# EAGLE schematic M865B (EAGLE 6.6.0)

## Sheet 1 of 2
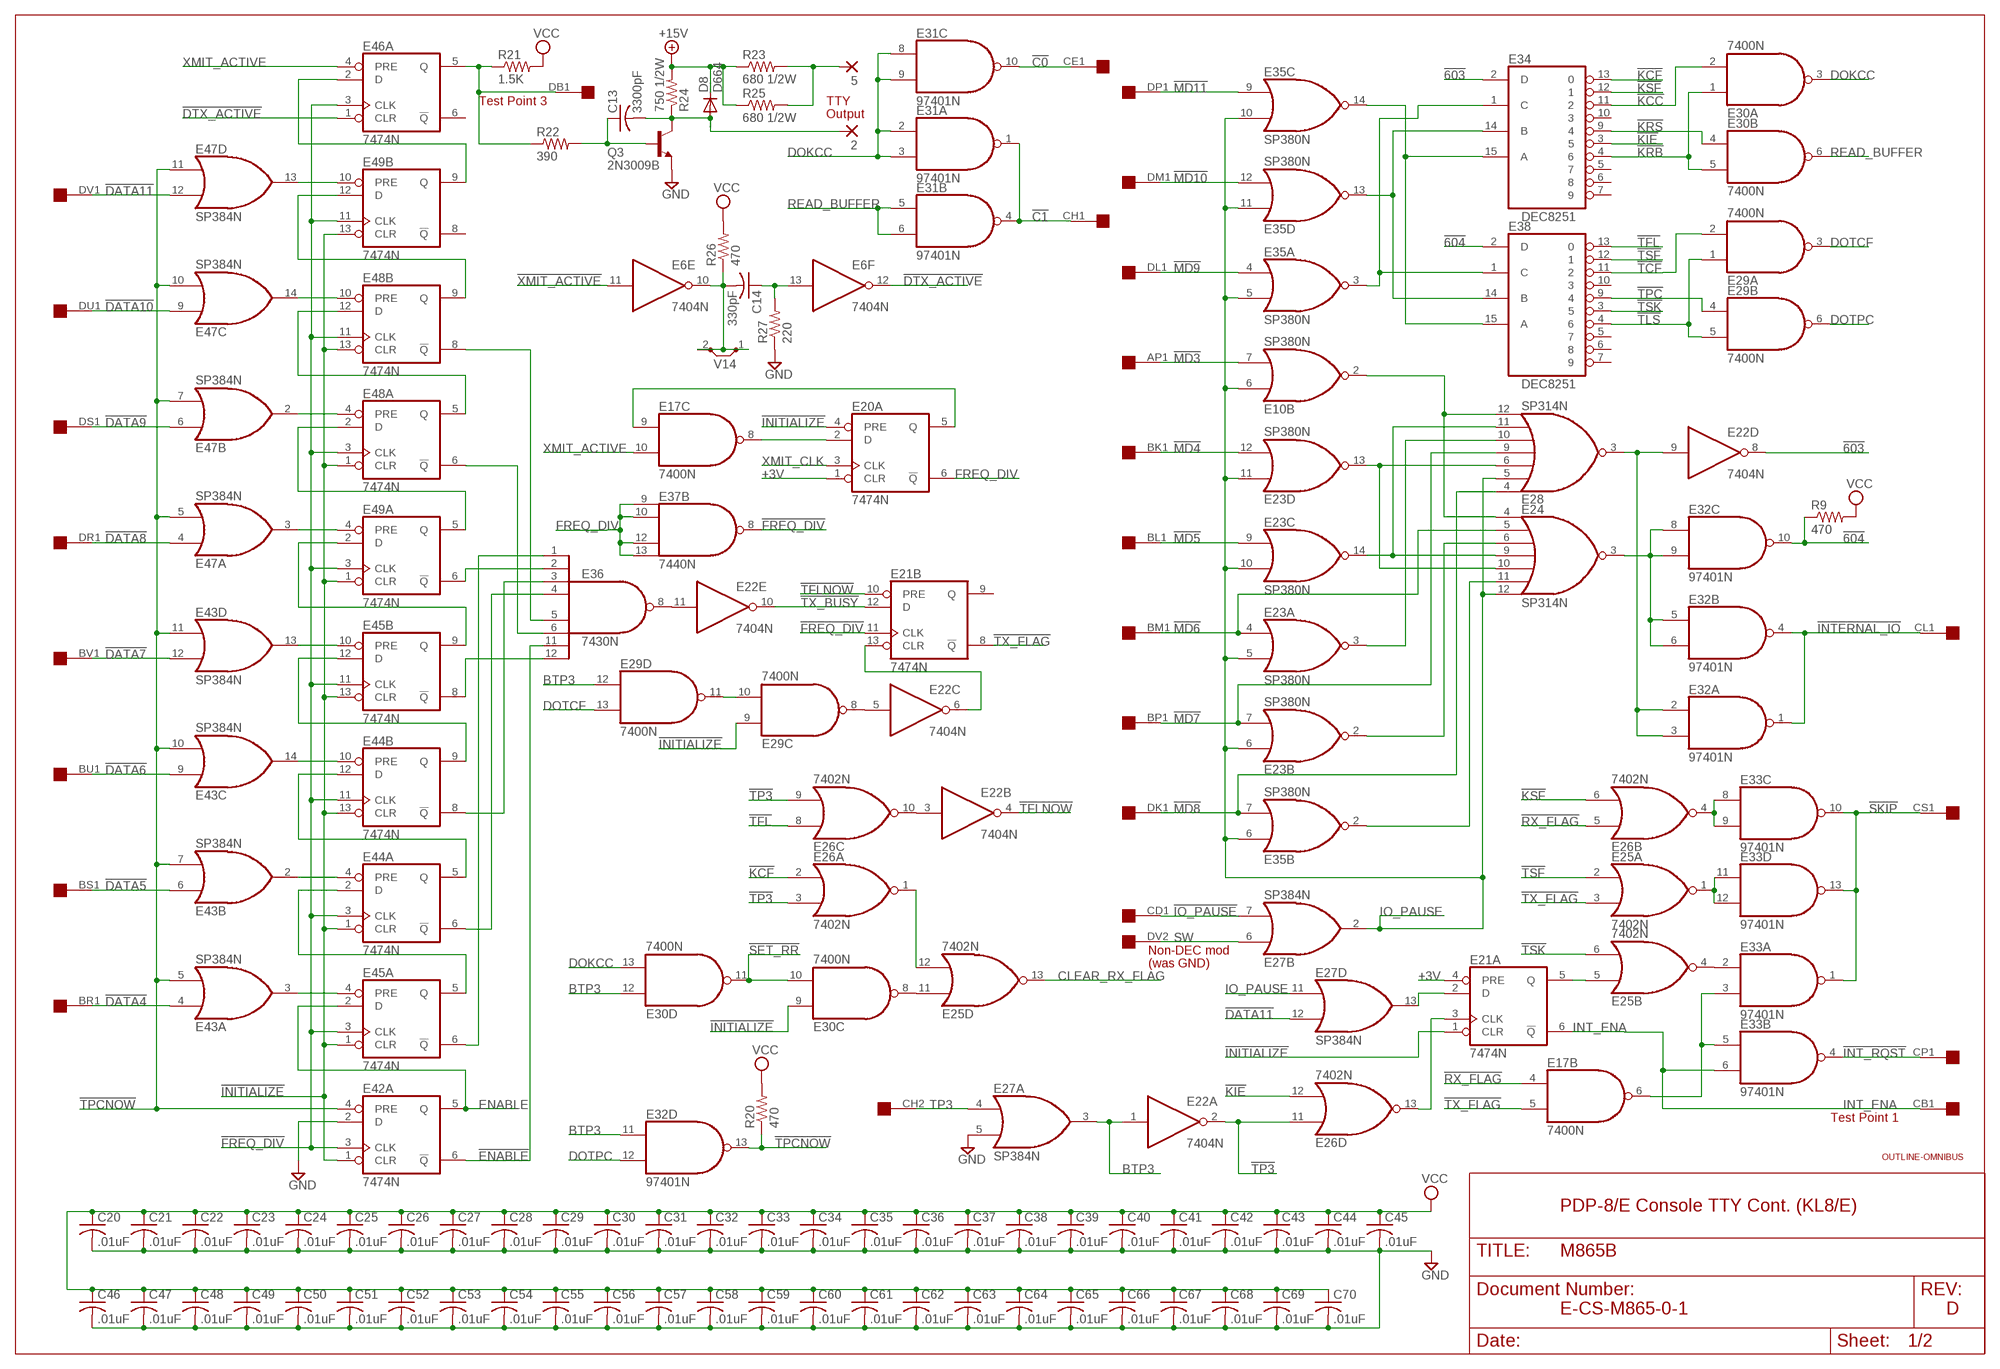
[diagram p0: schematic, sheet 1]

### Parts
2  2,15/1,0  [2,15/1,0]
5  2,15/1,0  [2,15/1,0]
C13  3300pF  C-US102-043X133  [C102-043X133]
C14  330pF  C-US050-025X075  [C050-025X075]
C20  .01uF  C-US050-025X075  [C050-025X075]
C21  .01uF  C-US050-025X075  [C050-025X075]
C22  .01uF  C-US050-025X075  [C050-025X075]
C23  .01uF  C-US050-025X075  [C050-025X075]
C24  .01uF  C-US050-025X075  [C050-025X075]
C25  .01uF  C-US050-025X075  [C050-025X075]
C26  .01uF  C-US050-025X075  [C050-025X075]
C27  .01uF  C-US050-025X075  [C050-025X075]
C28  .01uF  C-US050-025X075  [C050-025X075]
C29  .01uF  C-US050-025X075  [C050-025X075]
C30  .01uF  C-US050-025X075  [C050-025X075]
C31  .01uF  C-US050-025X075  [C050-025X075]
C32  .01uF  C-US050-025X075  [C050-025X075]
C33  .01uF  C-US050-025X075  [C050-025X075]
C34  .01uF  C-US050-025X075  [C050-025X075]
C35  .01uF  C-US050-025X075  [C050-025X075]
C36  .01uF  C-US050-025X075  [C050-025X075]
C37  .01uF  C-US050-025X075  [C050-025X075]
C38  .01uF  C-US050-025X075  [C050-025X075]
C39  .01uF  C-US050-025X075  [C050-025X075]
C40  .01uF  C-US050-025X075  [C050-025X075]
C41  .01uF  C-US050-025X075  [C050-025X075]
C42  .01uF  C-US050-025X075  [C050-025X075]
C43  .01uF  C-US050-025X075  [C050-025X075]
C44  .01uF  C-US050-025X075  [C050-025X075]
C45  .01uF  C-US050-025X075  [C050-025X075]
C46  .01uF  C-US050-025X075  [C050-025X075]
C47  .01uF  C-US050-025X075  [C050-025X075]
C48  .01uF  C-US050-025X075  [C050-025X075]
C49  .01uF  C-US050-025X075  [C050-025X075]
C50  .01uF  C-US050-025X075  [C050-025X075]
C51  .01uF  C-US050-025X075  [C050-025X075]
C52  .01uF  C-US050-025X075  [C050-025X075]
C53  .01uF  C-US050-025X075  [C050-025X075]
C54  .01uF  C-US050-025X075  [C050-025X075]
C55  .01uF  C-US050-025X075  [C050-025X075]
C56  .01uF  C-US050-025X075  [C050-025X075]
C57  .01uF  C-US050-025X075  [C050-025X075]
C58  .01uF  C-US050-025X075  [C050-025X075]
C59  .01uF  C-US050-025X075  [C050-025X075]
C60  .01uF  C-US050-025X075  [C050-025X075]
C61  .01uF  C-US050-025X075  [C050-025X075]
C62  .01uF  C-US050-025X075  [C050-025X075]
C63  .01uF  C-US050-025X075  [C050-025X075]
C64  .01uF  C-US050-025X075  [C050-025X075]
C65  .01uF  C-US050-025X075  [C050-025X075]
C66  .01uF  C-US050-025X075  [C050-025X075]
C67  .01uF  C-US050-025X075  [C050-025X075]
C68  .01uF  C-US050-025X075  [C050-025X075]
C69  .01uF  C-US050-025X075  [C050-025X075]
C70  .01uF  C-US050-025X075  [C050-025X075]
D8  D664  DIODE-DO35-10  [DO35-10]
E6  7404N  [DIL14]
E10  SP380N  [DIL14]
E17  7400N  [DIL14]
E20  7474N  74S74N  [DIL14]
E21  7474N  74S74N  [DIL14]
E22  7404N  [DIL14]
E23  SP380N  [DIL14]
E24  SP314N  [DIL14]
E25  7402N  [DIL14]
E26  7402N  [DIL14]
E27  SP384N  [DIL14]
E28  SP314N  [DIL14]
E29  7400N  [DIL14]
E30  7400N  [DIL14]
E31  97401N  74LS01N  [DIL14]
E32  97401N  74LS01N  [DIL14]
E33  97401N  74LS01N  [DIL14]
E34  DEC8251  [DIL16]
E35  SP380N  [DIL14]
E36  7430N  [DIL14]
E37  7440N  [DIL14]
E38  DEC8251  [DIL16]
E42  7474N  74S74N  [DIL14]
E43  SP384N  [DIL14]
E44  7474N  74S74N  [DIL14]
E45  7474N  74S74N  [DIL14]
E46  7474N  74S74N  [DIL14]
E47  SP384N  [DIL14]
E48  7474N  74S74N  [DIL14]
E49  7474N  74S74N  [DIL14]
Q3  2N3009B  -NPN-TO5  [TO5]
R9  470  R-US_0207/10  [0207/10]
R20  470  R-US_0207/10  [0207/10]
R21  1.5K  R-US_0207/10  [0207/10]
R22  390  R-US_0207/10  [0207/10]
R23  680 1/2W  R-US_0411/15  [0411/15]
R24  750 1/2W  R-US_0411/15  [0411/15]
R25  680 1/2W  R-US_0411/15  [0411/15]
R26  470  R-US_0207/10  [0207/10]
R27  220  R-US_0207/10  [0207/10]
U$1  QUAD  [EDGE-CON8]
U$2  OUTLINE-OMNIBUS  [OMNIBUS]
V14  J10MM  [10]

### Nets
603X: E22.9(D:I) E28.3(O) E32.2(A:I0) E32.3(A:I1)
604X: E24.3(O) E32.5(B:I0) E32.6(B:I1) E32.8(C:I0) E32.9(C:I1)
!603: E22.8(D:O) E34.2(D)
!604: E32.10(C:O) E38.2(D) R9.1
!C0: E31.10(C:O) U$1.CE1
!C1: E31.1(A:O) E31.4(B:O) U$1.CH1
!DATA4: E43.4(A:I0) U$1.BR1 ; also sheet 2
!DATA5: E43.6(B:I0) U$1.BS1 ; also sheet 2
!DATA6: E43.9(C:I0) U$1.BU1 ; also sheet 2
!DATA7: E43.12(D:I1) U$1.BV1 ; also sheet 2
!DATA8: E47.4(A:I0) U$1.DR1 ; also sheet 2
!DATA9: E47.6(B:I0) U$1.DS1 ; also sheet 2
!DATA10: E47.9(C:I0) U$1.DU1 ; also sheet 2
!DATA11: E27.12(D:I1) E47.12(D:I1) U$1.DV1 ; also sheet 2
!DTX_ACTIVE: E6.12(F:O) E46.1(A:CLR)
!ENABLE: E36.11(I6) E42.6(A:!Q)
!FREQ_DIV: E21.11(B:CLK) E37.8(B:O) E42.3(A:CLK) E44.3(A:CLK) E44.11(B:CLK) E45.3(A:CLK) E45.11(B:CLK) E46.3(A:CLK) E48.3(A:CLK) E48.11(B:CLK) E49.3(A:CLK) E49.11(B:CLK) ; also sheet 2
!INITIALIZE: E20.4(A:PRE) E21.1(A:CLR) E29.9(C:I0) E30.9(C:I0) E42.1(A:CLR) E44.1(A:CLR) E44.13(B:CLR) E45.1(A:CLR) E45.13(B:CLR) E48.1(A:CLR) E48.13(B:CLR) E49.1(A:CLR) E49.13(B:CLR) ; also sheet 2
!INT_ENA: E21.5(A:Q) E25.5(B:I0)
!INT_RQST: E33.4(B:O) U$1.CP1
!INTERNAL_IO: E32.1(A:O) E32.4(B:O) U$1.CL1
!IO_PAUSE: E27.7(B:I1) U$1.CD1
!KCC: E30.2(A:I1) E34.11
!KCF: E26.2(A:I0) E34.13
!KIE: E26.12(D:I1) E34.3
!KRB: E30.1(A:I0) E30.5(B:I1) E34.4
!KRS: E30.4(B:I0) E34.9
!KSF: E26.6(B:I1) E34.12
!MD3: E10.7(B:I1) U$1.AP1
!MD4: E23.12(D:I1) U$1.BK1
!MD5: E23.9(C:I0) U$1.BL1
!MD6: E23.4(A:I0) E24.5(I1) U$1.BM1
!MD7: E23.7(B:I1) E28.9(I3) U$1.BP1
!MD8: E28.4(I0) E35.7(B:I1) U$1.DK1
!MD9: E35.4(A:I0) U$1.DL1
!MD10: E35.12(D:I1) U$1.DM1
!MD11: E35.9(C:I0) U$1.DP1
!RX_FLAG: E17.4(B:I0) E26.5(B:I0) ; also sheet 2
!SET_RR: E30.10(C:I1) E30.11(D:O) ; also sheet 2
!SKIP: E33.1(A:O) E33.10(C:O) E33.13(D:O) U$1.CS1
!TCF: E29.2(A:I1) E38.11
!TFL: E26.8(C:I0) E38.13
!TFLNOW: E21.10(B:PRE) E22.4(B:O)
!TLS: E29.1(A:I0) E29.5(B:I1) E38.4
!TP3: E22.2(A:O) E26.3(A:I1) E26.9(C:I1) E26.11(D:I0)
!TPC: E29.4(B:I0) E38.9
!TPCNOW: E32.13(D:O) E42.4(A:PRE) E43.5(A:I1) E43.7(B:I1) E43.10(C:I1) E43.11(D:I0) E47.5(A:I1) E47.7(B:I1) E47.10(C:I1) E47.11(D:I0) R20.1
!TSF: E25.2(A:I0) E38.12
!TSK: E25.6(B:I1) E38.3
!TX_BUSY: E21.12(B:D) E22.10(E:O) ; also sheet 2
!TX_FLAG: E17.5(B:I1) E21.8(B:!Q) E25.3(A:I1)
!XMIT_ACTIVE: E6.11(E:I) ; also sheet 2
+3V [Supply]: E20.1(A:CLR) E21.4(A:PRE) ; also sheet 2
+15V [Supply]: D8.C R23.1 R24.2 R25.1 ; also sheet 2
BTP3: E22.1(A:I) E27.3(A:O) E29.12(D:I0) E30.12(D:I0) E32.11(D:I0)
CLEAR_RX_FLAG: E25.13(D:O) ; also sheet 2
DOKCC: E30.3(A:O) E30.13(D:I1) E31.2(A:I0) E31.3(A:I1) E31.8(C:I0) E31.9(C:I1)
DOTCF: E29.3(A:O) E29.13(D:I1)
DOTPC: E29.6(B:O) E32.12(D:I1)
ENABLE: E42.5(A:Q) E45.2(A:D) ; also sheet 2
FREQ_DIV: E20.6(A:!Q) E37.9(B:I0) E37.10(B:I1) E37.12(B:I2) E37.13(B:I3) ; also sheet 2
GND [Supply]: C20.2 C21.2 C22.2 C23.2 C24.2 C25.2 C26.2 C27.2 C28.2 C29.2 C30.2 C31.2 C32.2 C33.2 C34.2 C35.2 C36.2 C37.2 C38.2 C39.2 C40.2 C41.2 C42.2 C43.2 C44.2 C45.2 C46.2 C47.2 C48.2 C49.2 C50.2 C51.2 C52.2 C53.2 C54.2 C55.2 C56.2 C57.2 C58.2 C59.2 C60.2 C61.2 C62.2 C63.2 C64.2 C65.2 C66.2 C67.2 C68.2 C69.2 C70.2 E27.5(A:I1) E42.2(A:D) Q3.1(E) R27.1 ; also sheet 2
INT_ENA: E21.6(A:!Q) E33.6(B:I1) U$1.CB1
IO_PAUSE: E10.6(B:I0) E23.5(A:I1) E23.6(B:I0) E23.10(C:I1) E23.11(D:I0) E24.12(I6) E27.2(B:O) E27.11(D:I0) E28.5(I1) E35.5(A:I1) E35.6(B:I0) E35.10(C:I1) E35.11(D:I0)
N$1: E25.11(D:I0) E30.8(C:O)
N$2: E47.13(D:O) E49.10(B:PRE)
N$3: E47.14(C:O) E48.10(B:PRE)
N$4: E47.2(B:O) E48.4(A:PRE)
N$5: E47.3(A:O) E49.4(A:PRE)
N$6: E48.9(B:Q) E49.12(B:D)
N$7: E22.5(C:I) E29.8(C:O)
N$9: E43.13(D:O) E45.10(B:PRE)
N$10: E43.14(C:O) E44.10(B:PRE)
N$11: E43.3(A:O) E45.4(A:PRE)
N$12: E43.2(B:O) E44.4(A:PRE)
N$13: E44.2(A:D) E45.5(A:Q)
N$14: E44.5(A:Q) E44.12(B:D)
N$15: E44.9(B:Q) E45.12(B:D)
N$16: E45.9(B:Q) E49.2(A:D)
N$17: E48.2(A:D) E49.5(A:Q)
N$18: E48.5(A:Q) E48.12(B:D)
N$20: E36.5(I4) E48.8(B:!Q)
N$21: E36.6(I5) E48.6(A:!Q)
N$22: E36.2(I1) E49.6(A:!Q)
N$23: E36.12(I7) E45.8(B:!Q)
N$24: E36.3(I2) E44.8(B:!Q)
N$25: E36.4(I3) E44.6(A:!Q)
N$26: E36.1(I0) E45.6(A:!Q)
N$28: E46.2(A:D) E49.9(B:Q)
N$31: E46.5(A:Q) R21.1 R22.1 U$1.DB1
N$32: E22.11(E:I) E36.8(O)
N$33: E24.11(I5) E35.2(B:O)
N$34: E23.2(B:O) E24.6(I2)
N$35: E23.3(A:O) E28.10(I4)
N$36: E23.14(C:O) E24.9(I3) E28.11(I5)
N$37: E23.13(D:O) E24.10(I4) E28.6(I2)
N$38: E10.2(B:O) E24.4(I0) E28.12(I6)
N$39: E26.4(B:O) E33.8(C:I0) E33.9(C:I1)
N$40: E34.15(A) E35.14(C:O) E38.15(A)
N$41: E34.14(B) E35.13(D:O) E38.14(B)
N$42: E34.1(C) E35.3(A:O) E38.1(C)
N$43: E25.1(A:O) E33.11(D:I0) E33.12(D:I1)
N$44: E17.6(B:O) E33.3(A:I1) E33.5(B:I0)
N$45: E21.2(A:D) E27.13(D:O)
N$46: E25.4(B:O) E33.2(A:I0)
N$47: E21.3(A:CLK) E26.13(D:O)
N$58: E17.8(C:O) E20.2(A:D)
N$64: E17.9(C:I0) E20.5(A:Q)
N$65: C13.1 Q3.2(B) R22.2
N$66: 2.1(P) C13.2 D8.A Q3.3(C) R24.1
N$67: 5.1(P) R23.2 R25.2
N$77: C14.2 E6.10(E:O) R26.1 V14.1 V14.2
N$78: C14.1 E6.13(F:I) R27.2
N$126: E25.12(D:I1) E26.1(A:O)
N$127: E22.3(B:I) E26.10(C:O)
N$128: E29.10(C:I1) E29.11(D:O)
N$130: E21.13(B:CLR) E22.6(C:O)
READ_BUFFER: E30.6(B:O) E31.5(B:I0) E31.6(B:I1) ; also sheet 2
SW: E27.6(B:I0) U$1.DV2
TP3: E27.4(A:I0) U$1.CH2
VCC [Supply]: C20.1 C21.1 C22.1 C23.1 C24.1 C25.1 C26.1 C27.1 C28.1 C29.1 C30.1 C31.1 C32.1 C33.1 C34.1 C35.1 C36.1 C37.1 C38.1 C39.1 C40.1 C41.1 C42.1 C43.1 C44.1 C45.1 C46.1 C47.1 C48.1 C49.1 C50.1 C51.1 C52.1 C53.1 C54.1 C55.1 C56.1 C57.1 C58.1 C59.1 C60.1 C61.1 C62.1 C63.1 C64.1 C65.1 C66.1 C67.1 C68.1 C69.1 C70.1 R9.2 R20.2 R21.2 R26.2 ; also sheet 2
XMIT_ACTIVE: E17.10(C:I1) E46.4(A:PRE) ; also sheet 2
XMIT_CLK: E20.3(A:CLK) ; also sheet 2
Unconnected: E17.1(A:I0) E17.2(A:I1) E17.3(A:O) E20.8(B:!Q) E20.9(B:Q) E20.10(B:PRE) E20.11(B:CLK) E20.12(B:D) E20.13(B:CLR) E21.9(B:Q) E31.11(D:I0) E31.12(D:I1) E31.13(D:O) E34.5 E34.6 E34.7 E34.10 E36.9 E36.10 E36.13 E37.3(3:NC) E37.11(11:NC) E38.5 E38.6 E38.7 E38.10 E46.6(A:!Q) E49.8(B:!Q) U$1.AB2 U$1.AC1 U$1.AD1 U$1.AD2 U$1.AE1 U$1.AE2 U$1.AH1 U$1.AH2 U$1.AJ1 U$1.AJ2 U$1.AK1 U$1.AK2 U$1.AL1 U$1.AL2 U$1.AM1 U$1.AM2 U$1.AP2 U$1.AR1 U$1.AR2 U$1.AS1 U$1.AS2 U$1.AU1 U$1.AU2 U$1.AV1 U$1.AV2 U$1.BB2 U$1.BD1 U$1.BD2 U$1.BE1 U$1.BE2 U$1.BH1 U$1.BH2 U$1.BJ1 U$1.BJ2 U$1.BK2 U$1.BL2 U$1.BM2 U$1.BP2 U$1.BR2 U$1.BS2 U$1.BU2 U$1.CB2 U$1.CD2 U$1.CE2 U$1.CJ1 U$1.CJ2 U$1.CK1 U$1.CK2 U$1.CL2 U$1.CM1 U$1.CM2 U$1.CP2 U$1.CR2 U$1.CS2 U$1.CU1 U$1.CU2 U$1.CV1 U$1.CV2 U$1.DD1 U$1.DD2 U$1.DE1 U$1.DE2 U$1.DH1 U$1.DH2 U$1.DJ1 U$1.DJ2 U$1.DK2 U$1.DL2 U$1.DM2 U$1.DP2 U$1.DR2 U$1.DS2 U$1.DU2

### Notes on the sheet
- Test Point 3 | TTY
- Output
- Non-DEC mod
- (was GND)
- Test Point 1
- PDP-8/E Console TTY Cont. (KL8/E)
- E-CS-M865-0-1 | D

## Sheet 2 of 2
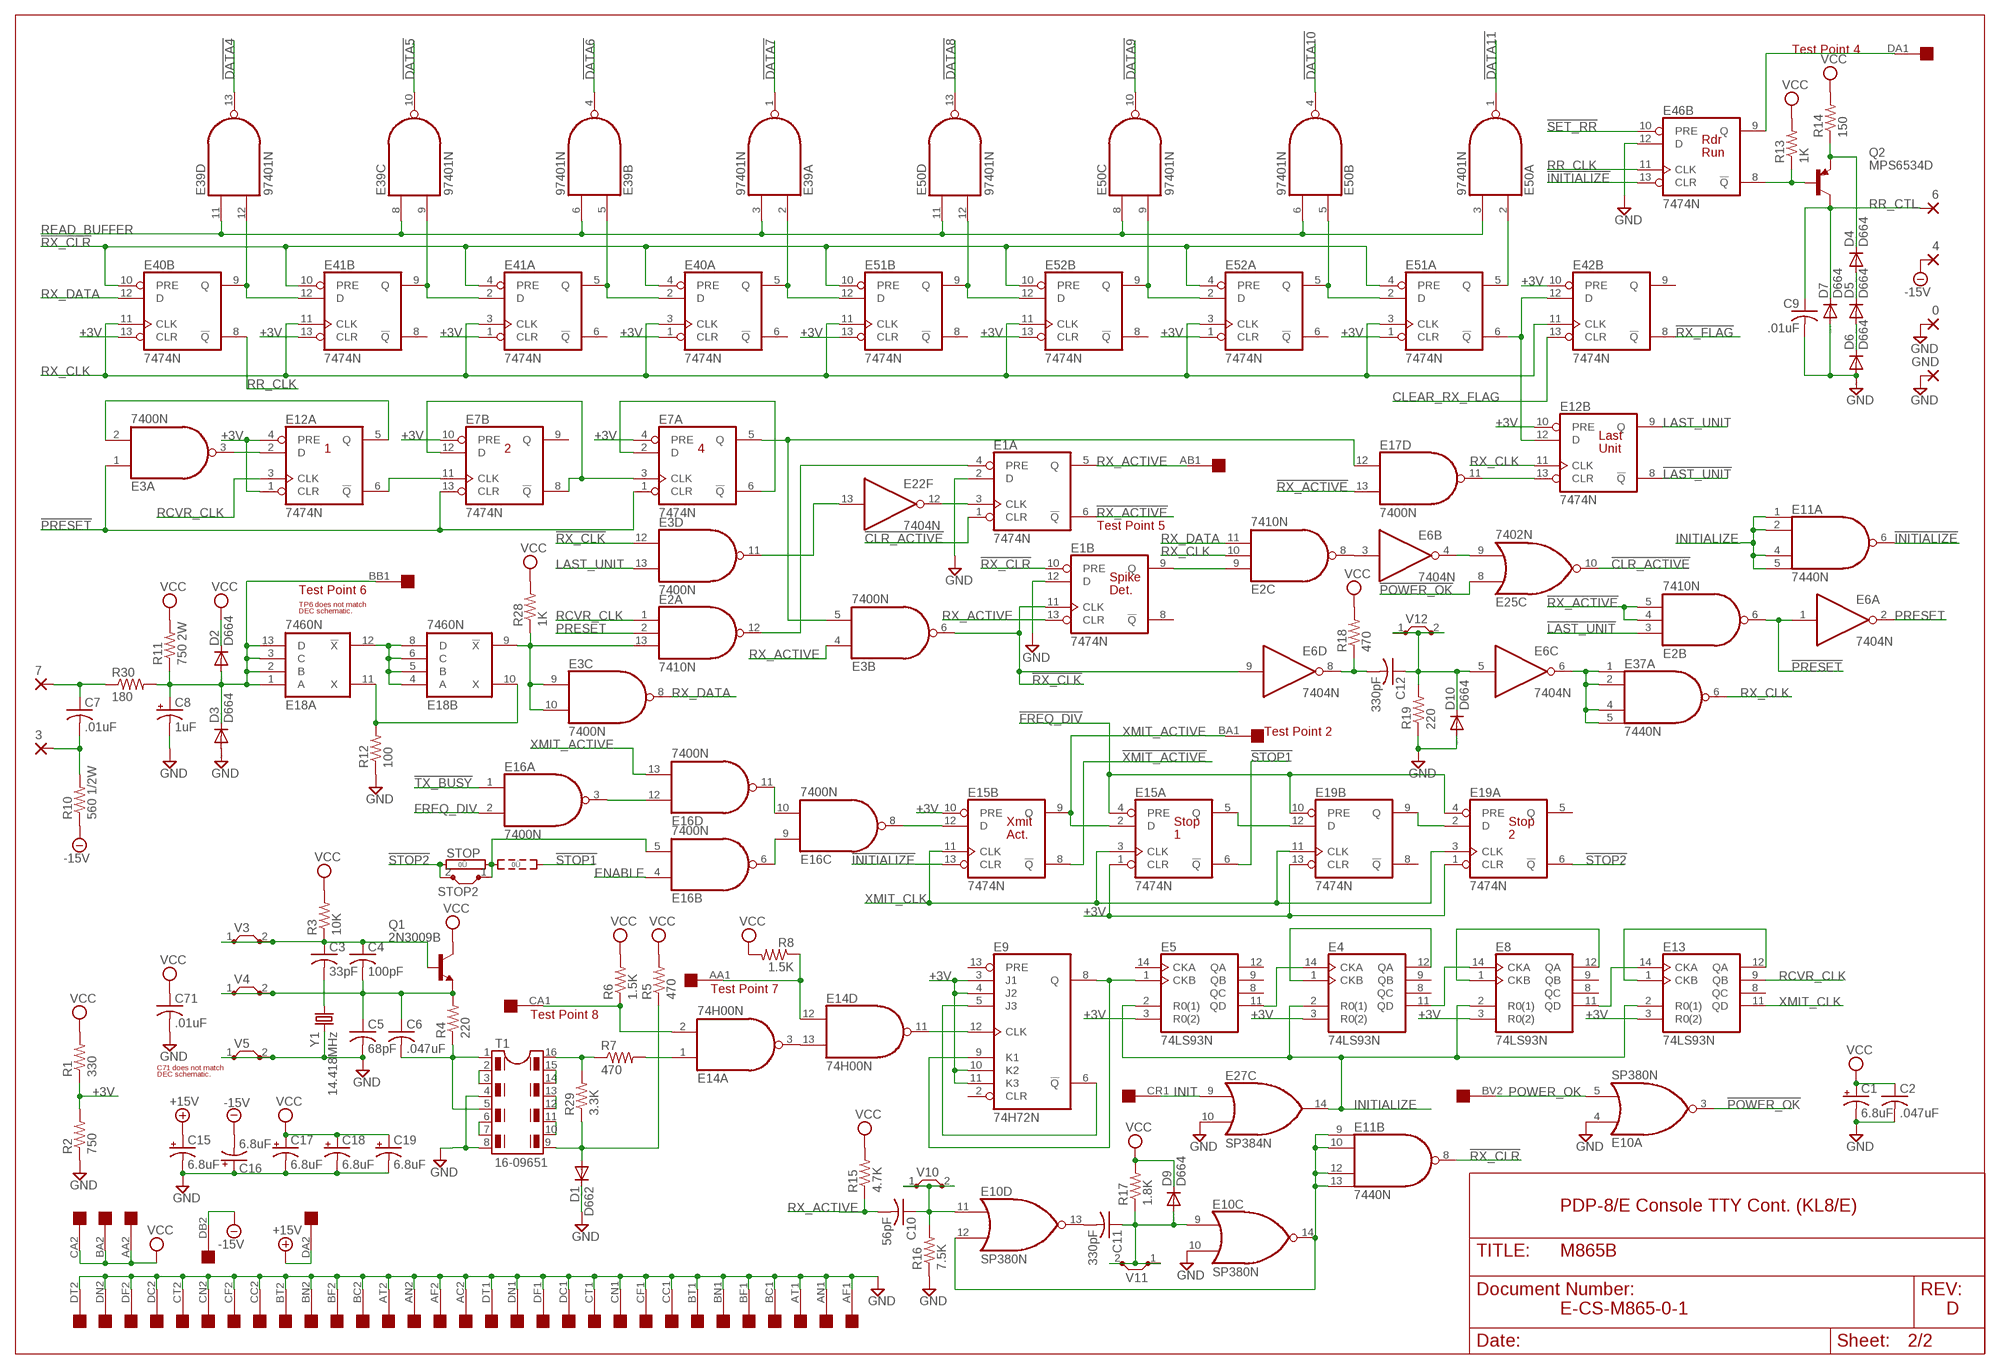
[diagram p1: schematic, sheet 2]

### Parts
0  2,15/1,0  [2,15/1,0]
3  2,15/1,0  [2,15/1,0]
4  2,15/1,0  [2,15/1,0]
6  2,15/1,0  [2,15/1,0]
7  2,15/1,0  [2,15/1,0]
C1  6.8uF  CPOL-USE20-8AXIAL  [E12-8]
C2  .047uF  C-US075-032X103  [C075-032X103]
C3  33pF  C-US050-025X075  [C050-025X075]
C4  100pF  C-US050-025X075  [C050-025X075]
C5  68pF  C-US050-025X075  [C050-025X075]
C6  .047uF  C-US075-032X103  [C075-032X103]
C7  .01uF  C-US050-025X075  [C050-025X075]
C8  1uF  CPOL-USE15-5AXIAL  [E15-5]
C9  .01uF  C-US050-025X075  [C050-025X075]
C10  56pF  C-US050-025X075  [C050-025X075]
C11  330pF  C-US050-025X075  [C050-025X075]
C12  330pF  C-US050-025X075  [C050-025X075]
C15  6.8uF  CPOL-USE20-8AXIAL  [E12-8]
C16  6.8uF  CPOL-USE20-8AXIAL  [E12-8]
C17  6.8uF  CPOL-USE20-8AXIAL  [E12-8]
C18  6.8uF  CPOL-USE20-8AXIAL  [E12-8]
C19  6.8uF  CPOL-USE20-8AXIAL  [E12-8]
C71  .01uF  C-US050-025X075  [C050-025X075]
D1  D662  DIODE-DO35-10  [DO35-10]
D2  D664  DIODE-DO35-10  [DO35-10]
D3  D664  DIODE-DO35-10  [DO35-10]
D4  D664  DIODE-DO35-10  [DO35-10]
D5  D664  DIODE-DO35-10  [DO35-10]
D6  D664  DIODE-DO35-10  [DO35-10]
D7  D664  DIODE-DO35-10  [DO35-10]
D9  D664  DIODE-DO35-10  [DO35-10]
D10  D664  DIODE-DO35-10  [DO35-10]
E1  7474N  74S74N  [DIL14]
E2  7410N  [DIL14]
E3  7400N  [DIL14]
E4  74LS93N  [DIL14]
E5  74LS93N  [DIL14]
E7  7474N  74S74N  [DIL14]
E8  74LS93N  [DIL14]
E9  74H72N  7472N  [DIL14]
E11  7440N  [DIL14]
E12  7474N  74S74N  [DIL14]
E13  74LS93N  [DIL14]
E14  74H00N  7400N  [DIL14]
E15  7474N  74S74N  [DIL14]
E16  7400N  [DIL14]
E18  7460N  [DIL14]
E19  7474N  74S74N  [DIL14]
E39  97401N  74LS01N  [DIL14]
E40  7474N  74S74N  [DIL14]
E41  7474N  74S74N  [DIL14]
E50  97401N  74LS01N  [DIL14]
E51  7474N  74S74N  [DIL14]
E52  7474N  74S74N  [DIL14]
GND  2,15/1,0  [2,15/1,0]
Q1  2N3009B  -NPN-TO5  [TO5]
Q2  MPS6534D  -PNP-TO5  [TO5]
R1  330  R-US_0207/10  [0207/10]
R2  750  R-US_0207/10  [0207/10]
R3  10K  R-US_0207/10  [0207/10]
R4  220  R-US_0207/10  [0207/10]
R5  470  R-US_0207/10  [0207/10]
R6  1.5K  R-US_0207/10  [0207/10]
R7  470  R-US_0207/10  [0207/10]
R8  1.5K  R-US_0207/10  [0207/10]
R10  560 1/2W  R-US_0411/15  [0411/15]
R11  750 2W  R-US_0818/25  [0818/25]
R12  100  R-US_0207/10  [0207/10]
R13  1K  R-US_0207/10  [0207/10]
R14  150  R-US_0207/10  [0207/10]
R15  4.7K  R-US_0207/10  [0207/10]
R16  7.5K  R-US_0207/10  [0207/10]
R17  1.8K  R-US_0207/10  [0207/10]
R18  470  R-US_0207/10  [0207/10]
R19  220  R-US_0207/10  [0207/10]
R28  1K  R-US_0207/10  [0207/10]
R29  3.3K  R-US_0207/10  [0207/10]
R30  180  R-US_0207/10  [0207/10]
STOP  0R2  [0R2/10]
STOP2  J10MM  [10]
T1  16-09651  DIL16  [DIL16]
V3  J10MM  [10]
V4  J10MM  [10]
V5  J10MM  [10]
V10  J10MM  [10]
V11  J10MM  [10]
V12  J10MM  [10]
Y1  14.418MHz  CRYSTALHC18U-H  [HC18U-H]

### Nets
!CLR_ACTIVE: E1.1(A:CLR) E25.10(C:O)
!DATA4: E39.13(D:O) ; also sheet 1
!DATA5: E39.10(C:O) ; also sheet 1
!DATA6: E39.4(B:O) ; also sheet 1
!DATA7: E39.1(A:O) ; also sheet 1
!DATA8: E50.13(D:O) ; also sheet 1
!DATA9: E50.10(C:O) ; also sheet 1
!DATA10: E50.4(B:O) ; also sheet 1
!DATA11: E50.1(A:O) ; also sheet 1
!FREQ_DIV: E15.4(A:PRE) E19.4(A:PRE) E19.10(B:PRE) ; also sheet 1
!INITIALIZE: E11.6(A:O) E15.13(B:CLR) E46.13(B:CLR) ; also sheet 1
!LAST_UNIT: E2.3(B:I0) E12.8(B:!Q)
!POWER_OK: E10.3(A:O) E25.8(C:I0)
!PRESET: E2.6(B:O) E3.1(A:I0) E6.1(A:I) E7.1(A:CLR) E7.13(B:CLR)
!RX_ACTIVE: E1.6(A:!Q) E2.4(B:I1) E2.5(B:I2) E17.13(D:I1)
!RX_CLK: E1.11(B:CLK) E3.6(B:O) E3.12(D:I0) E6.9(D:I)
!RX_CLR: E1.10(B:PRE) E11.8(B:O) E40.4(A:PRE) E40.10(B:PRE) E41.4(A:PRE) E41.10(B:PRE) E51.4(A:PRE) E51.10(B:PRE) E52.4(A:PRE) E52.10(B:PRE)
!RX_FLAG: E42.8(B:!Q) ; also sheet 1
!SET_RR: E46.10(B:PRE) ; also sheet 1
!STOP1: E15.6(A:!Q) STOP.3
!STOP2: E19.6(A:!Q) STOP2.2 STOP.1
!TX_BUSY: E16.1(A:I0) ; also sheet 1
!XMIT_ACTIVE: E15.8(B:!Q) ; also sheet 1
+3V [Supply]: E4.3(R0(2)) E5.3(R0(2)) E7.4(A:PRE) E7.10(B:PRE) E8.3(R0(2)) E9.3(J1) E9.4(J2) E9.10(K2) E9.11(K3) E12.1(A:CLR) E12.4(A:PRE) E12.10(B:PRE) E13.3(R0(2)) E15.1(A:CLR) E15.10(B:PRE) E19.1(A:CLR) E19.13(B:CLR) E40.1(A:CLR) E40.13(B:CLR) E41.1(A:CLR) E41.13(B:CLR) E42.10(B:PRE) E51.1(A:CLR) E51.13(B:CLR) E52.1(A:CLR) E52.13(B:CLR) R1.1 R2.2 ; also sheet 1
+15V [Supply]: C15.+ U$1.DA2 ; also sheet 1
-15V [Supply]: 4.1(P) C16.- R10.1 U$1.DB2
CLEAR_RX_FLAG: E42.13(B:CLR) ; also sheet 1
ENABLE: E16.4(B:I0) ; also sheet 1
FREQ_DIV: E16.2(A:I1) ; also sheet 1
GND [Supply]: 0.1(P) C1.- C2.2 C5.2 C8.- C9.2 C15.- C16.+ C17.- C18.- C19.- C71.2 D1.C D3.A D6.A D7.A D10.A E1.2(A:D) E1.12(B:D) E10.4(A:I0) E10.10(C:I1) E27.10(C:I1) E46.12(B:D) GND.1(P) R2.1 R12.1 R16.1 R19.1 T1.4 T1.8 U$1.AC2 U$1.AF1 U$1.AF2 U$1.AN1 U$1.AN2 U$1.AT1 U$1.AT2 U$1.BC1 U$1.BC2 U$1.BF1 U$1.BF2 U$1.BN1 U$1.BN2 U$1.BT1 U$1.BT2 U$1.CC1 U$1.CC2 U$1.CF1 U$1.CF2 U$1.CN1 U$1.CN2 U$1.CT1 U$1.CT2 U$1.DC1 U$1.DC2 U$1.DF1 U$1.DF2 U$1.DN1 U$1.DN2 U$1.DT1 U$1.DT2 V5.1 V5.2 Y1.2 ; also sheet 1
INIT: E27.9(C:I0) U$1.CR1
INITIALIZE: E4.2(R0(1)) E5.2(R0(1)) E8.2(R0(1)) E11.1(A:I0) E11.2(A:I1) E11.4(A:I2) E11.5(A:I3) E13.2(R0(1)) E27.14(C:O)
LAST_UNIT: E3.13(D:I1) E12.9(B:Q)
N$8: C4.2 C5.1 C6.1 Q1.1(E) R4.2 V4.1 V4.2
N$19: 7.1(P) C7.1 R30.1
N$50: C6.2 R4.1 T1.1 T1.5
N$51: E14.1(A:I0) R7.2
N$52: E14.2(A:I1) R6.1 U$1.CA1
N$53: E9.5(J3) E9.6(!Q)
N$54: E5.1(CKB) E9.8(Q) E9.9(K1)
N$55: C3.1 C4.1 Q1.2(B) R3.1 V3.1 V3.2
N$56: C3.2 Y1.1
N$57: E4.14(CKA) E5.11(QD)
N$59: T1.6 T1.7
N$60: T1.2 T1.3
N$61: T1.14 T1.15
N$62: T1.12 T1.13
N$63: T1.10 T1.11
N$68: E16.10(C:I1) E16.11(D:O)
N$69: E16.6(B:O) E16.9(C:I0)
N$70: E16.3(A:O) E16.12(D:I0)
N$71: E15.12(B:D) E16.8(C:O)
N$72: E4.1(CKB) E4.12(QA)
N$73: E15.5(A:Q) E19.12(B:D)
N$74: E19.2(A:D) E19.9(B:Q)
N$76: E16.5(B:I1) STOP2.1 STOP.2
N$79: E39.9(C:I1) E41.2(A:D) E41.9(B:Q)
N$80: E4.11(QD) E8.14(CKA)
N$81: E14.3(A:O) E14.13(D:I1)
N$82: E14.12(D:I0) R8.1 U$1.AA1
N$83: E9.12(CLK) E14.11(D:O)
N$84: E8.1(CKB) E8.12(QA)
N$85: E8.11(QD) E13.14(CKA)
N$86: E13.1(CKB) E13.12(QA)
N$88: E3.3(A:O) E12.2(A:D)
N$89: E3.2(A:I1) E12.5(A:Q)
N$90: E7.11(B:CLK) E12.6(A:!Q)
N$92: E7.3(A:CLK) E7.8(B:!Q) E7.12(B:D)
N$93: E50.2(A:I0) E51.5(A:Q)
N$94: E7.2(A:D) E7.6(A:!Q)
N$95: E39.12(D:I1) E40.9(B:Q) E41.12(B:D)
N$97: E39.5(B:I0) E40.2(A:D) E41.5(A:Q)
N$98: E39.2(A:I0) E40.5(A:Q) E51.12(B:D)
N$99: E50.12(D:I1) E51.9(B:Q) E52.12(B:D)
N$100: E50.9(C:I1) E52.2(A:D) E52.9(B:Q)
N$101: E50.5(B:I0) E51.2(A:D) E52.5(A:Q)
N$105: E18.10(B:X) E18.11(A:X) R12.2
N$106: 3.1(P) C7.2 R10.2
N$107: C8.+ D2.A D3.C E18.1(A:A) E18.2(A:B) E18.3(A:C) E18.13(A:D) R11.1 R30.2 U$1.BB1
N$109: E18.4(B:A) E18.5(B:B) E18.6(B:C) E18.8(B:D) E18.12(A:!X)
N$110: E1.4(A:PRE) E2.12(A:O)
N$111: E2.13(A:I2) E3.9(C:I0) E3.10(C:I1) E18.9(B:!X) R28.1
N$113: D4.C Q2.1(E) R14.1
N$114: E46.8(B:!Q) Q2.2(B) R13.1
N$115: D4.A D5.C
N$116: D5.A D6.C
N$117: E46.9(B:Q) U$1.DA1
N$119: C10.1 E10.11(D:I0) R16.2 V10.1 V10.2
N$120: C11.2 E10.13(D:O)
N$121: C11.1 D9.A E10.9(C:I0) R17.1 V11.1 V11.2
N$122: E10.12(D:I1) E10.14(C:O) E11.9(B:I0) E11.10(B:I1) E11.12(B:I2) E11.13(B:I3)
N$123: C12.2 E6.8(D:O) R18.1
N$124: C12.1 D10.C E6.5(C:I) R19.2 V12.1 V12.2
N$125: E6.6(C:O) E37.1(A:I0) E37.2(A:I1) E37.4(A:I2) E37.5(A:I3)
N$131: E1.9(B:Q) E2.9(C:I0)
N$133: E12.13(B:CLR) E17.11(D:O)
N$134: E3.5(B:I1) E7.5(A:Q) E17.12(D:I0)
N$135: E6.4(B:O) E25.9(C:I1)
N$136: E2.8(C:O) E6.3(B:I)
N$137: E3.11(D:O) E22.13(F:I)
N$138: E1.3(A:CLK) E22.12(F:O)
N$150: R7.1 R29.2 T1.16
N$151: D1.A R5.1 R29.1 T1.9
POWER_OK: E10.5(A:I1) U$1.BV2
PRESET: E2.2(A:I1) E6.2(A:O)
RCVR_CLK: E2.1(A:I0) E12.3(A:CLK) E13.9(QB)
READ_BUFFER: E39.3(A:I1) E39.6(B:I1) E39.8(C:I0) E39.11(D:I0) E50.3(A:I1) E50.6(B:I1) E50.8(C:I0) E50.11(D:I0) ; also sheet 1
RR_CLK: E40.8(B:!Q) E46.11(B:CLK)
RR_CTL: 6.1(P) C9.1 D7.C Q2.3(C)
RX_ACTIVE: C10.2 E1.5(A:Q) E1.13(B:CLR) E3.4(B:I0) R15.1 U$1.AB1
RX_CLK: E2.10(C:I1) E12.11(B:CLK) E37.6(A:O) E40.3(A:CLK) E40.11(B:CLK) E41.3(A:CLK) E41.11(B:CLK) E42.11(B:CLK) E51.3(A:CLK) E51.11(B:CLK) E52.3(A:CLK) E52.11(B:CLK)
RX_DATA: E2.11(C:I2) E3.8(C:O) E40.12(B:D)
SET_LAST: E12.12(B:D) E42.12(B:D) E51.6(A:!Q)
VCC [Supply]: C1.+ C2.1 C17.+ C18.+ C19.+ C71.1 D2.C D9.C Q1.3(C) R1.2 R3.2 R5.2 R6.2 R8.2 R11.2 R13.2 R14.2 R15.2 R17.2 R18.2 R28.2 U$1.AA2 U$1.BA2 U$1.CA2 ; also sheet 1
XMIT_ACTIVE: E15.2(A:D) E15.9(B:Q) E16.13(D:I1) U$1.BA1 ; also sheet 1
XMIT_CLK: E13.11(QD) E15.3(A:CLK) E15.11(B:CLK) E19.3(A:CLK) E19.11(B:CLK) ; also sheet 1
Unconnected: E1.8(B:!Q) E4.8(QC) E4.9(QB) E5.8(QC) E5.9(QB) E5.12(QA) E5.14(CKA) E7.9(B:Q) E8.8(QC) E8.9(QB) E9.2(CLR) E9.13(PRE) E11.3(3:NC) E11.11(11:NC) E13.8(QC) E14.4(B:I0) E14.5(B:I1) E14.6(B:O) E14.8(C:O) E14.9(C:I0) E14.10(C:I1) E19.5(A:Q) E19.8(B:!Q) E40.6(A:!Q) E41.6(A:!Q) E41.8(B:!Q) E42.9(B:Q) E51.8(B:!Q) E52.6(A:!Q) E52.8(B:!Q)

### Notes on the sheet
- Test Point 4
- Rdr
- Run
- Last
- 1 | 2 | 4 | Unit
- Test Point 5
- Spike
- Test Point 6 | Det.
- TP6 does not match
- DEC schematic.
- Test Point 2
- Xmit | Stop | Stop
- Act. | 1 | 2
- Test Point 7
- Test Point 8
- C71 does not match
- DEC schematic.
- PDP-8/E Console TTY Cont. (KL8/E)
- E-CS-M865-0-1 | D

## Power pins joined to a net without a drawn wire
GND: E1.7(P:GND) E2.7(P:GND) E3.7(P:GND) E4.10(GND) E5.10(GND) E6.7(P:GND) E7.7(P:GND) E8.10(GND) E9.7(GND) E10.1(P:GND) E11.7(P:GND) E12.7(P:GND) E13.10(GND) E14.7(P:GND) E15.7(P:GND) E16.7(P:GND) E17.7(P:GND) E18.7(P:GND) E19.7(P:GND) E20.7(P:GND) E21.7(P:GND) E22.7(P:GND) E23.1(P:GND) E24.1(GND) E25.7(P:GND) E26.7(P:GND) E27.1(GND) E28.1(GND) E29.7(P:GND) E30.7(P:GND) E31.7(P:GND) E32.7(P:GND) E33.7(P:GND) E34.8(GND) E35.1(P:GND) E36.7(GND) E37.7(P:GND) E38.8(GND) E39.7(P:GND) E40.7(P:GND) E41.7(P:GND) E42.7(P:GND) E43.1(GND) E44.7(P:GND) E45.7(P:GND) E46.7(P:GND) E47.1(GND) E48.7(P:GND) E49.7(P:GND) E50.7(P:GND) E51.7(P:GND) E52.7(P:GND)
VCC: E1.14(P:VCC) E2.14(P:VCC) E3.14(P:VCC) E4.5(VCC) E5.5(VCC) E6.14(P:VCC) E7.14(P:VCC) E8.5(VCC) E9.14(VCC) E10.8(P:VCC) E11.14(P:VCC) E12.14(P:VCC) E13.5(VCC) E14.14(P:VCC) E15.14(P:VCC) E16.14(P:VCC) E17.14(P:VCC) E18.14(P:VCC) E19.14(P:VCC) E20.14(P:VCC) E21.14(P:VCC) E22.14(P:VCC) E23.8(P:VCC) E24.8(VCC) E25.14(P:VCC) E26.14(P:VCC) E27.8(VCC) E28.8(VCC) E29.14(P:VCC) E30.14(P:VCC) E31.14(P:VCC) E32.14(P:VCC) E33.14(P:VCC) E34.16(VCC) E35.8(P:VCC) E36.14(VCC) E37.14(P:VCC) E38.16(VCC) E39.14(P:VCC) E40.14(P:VCC) E41.14(P:VCC) E42.14(P:VCC) E43.8(VCC) E44.14(P:VCC) E45.14(P:VCC) E46.14(P:VCC) E47.8(VCC) E48.14(P:VCC) E49.14(P:VCC) E50.14(P:VCC) E51.14(P:VCC) E52.14(P:VCC)

## Library data of the parts
0 2-7 GND = wirepad:2,15/1,0: THROUGH-HOLE PAD
C1 C15-C19 = dec-con:CPOL-USE20-8AXIAL: A 0.8 inch electrolytic.
C2-C7 C9-C14 C20-C71 = rcl:C-US: CAPACITOR, American symbol
C8 = dec-con:CPOL-USE15-5AXIAL: 0.5" veresion of an electrolytic
D1-D10 = diode:DIODE-: DIODE
E1 E7 E12 E15 E19-E21 E40-E42 E44-E46 E48 E49 E51 E52 = 74xx-us:74*74: Dual D type positive edge triggered FLIP FLOP, preset and clear
E2 = 74xx-us:74*10: Triple 3-input NAND gate
E3 E14 E16 E17 E29 E30 = 74xx-us:74*00: Quad 2-input NAND gate
E4 E5 E8 E13 = 74xx-us:74*93: Decade, divide by twelve and binary COUNTER
E6 E22 = 74xx-us:74*04: Hex INVERTER
E9 = 74xx-us:74*72: AND gated J-K master slave FLIP FLOP, preset and clear
E10 E23 E35 = dec-con:SP380: Quad NOR gate (use 8640)
E11 E37 = dec-con:74*40: Dual 4-input NAND gate
E18 = 74xx-us:74*60: Dual 4-input EXPANDER
E24 E28 = dec-con:SP314: 7-Input NOR gate
E25 E26 = 74xx-us:74*02: Quad 2-input NOR gate
E27 E43 E47 = dec-con:SP384: Quad OR gate
E31-E33 E39 E50 = 74xx-us:74*01: Quad 2-input NAND gate, open collector
E34 E38 = dec-con:DEC8251: BCD Decoder
E36 = dec-con:74*30: 8-input NAND gate
Q1 Q3 = transistor:*-NPN-: NPN Transistror BF959 corrected 2008.03.06
Q2 = transistor:*-PNP-: PNP Transistror
R1-R10 R12-R30 = rcl:R-US_: RESISTOR, American symbol
R11 = dec-con:R-US_0818/25: One inch resistor
STOP = jumper:0R2: Bridge switch 0R 2 x 10mm
STOP2 V3-V5 V10-V12 V14 = jumper:J: Bridge
T1 = ic-package:DIL16: Dual In Line / Socket
U$1 = dec-con:QUAD: Quad-Height DEC board
U$2 = dec-con:OUTLINE-*: Board outlines for DEC boards.
Y1 = crystal:CRYSTAL: CRYSTAL; OC_FARNELL: unknown; OC_NEWARK: unknown

## Net classes
1 Supply: width 0.813 mm